# Altium schematic sheet esp32_c6_a1_mcu.SchDoc
size A3; SheetNumber: 2; SheetTotal: 2
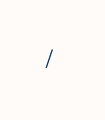
[diagram p0: esp32_c6_a1_mcu.SchDoc]

## Notes on the sheet
- /